# Altium project Self_Sensing_Board_V1.PrjPcb
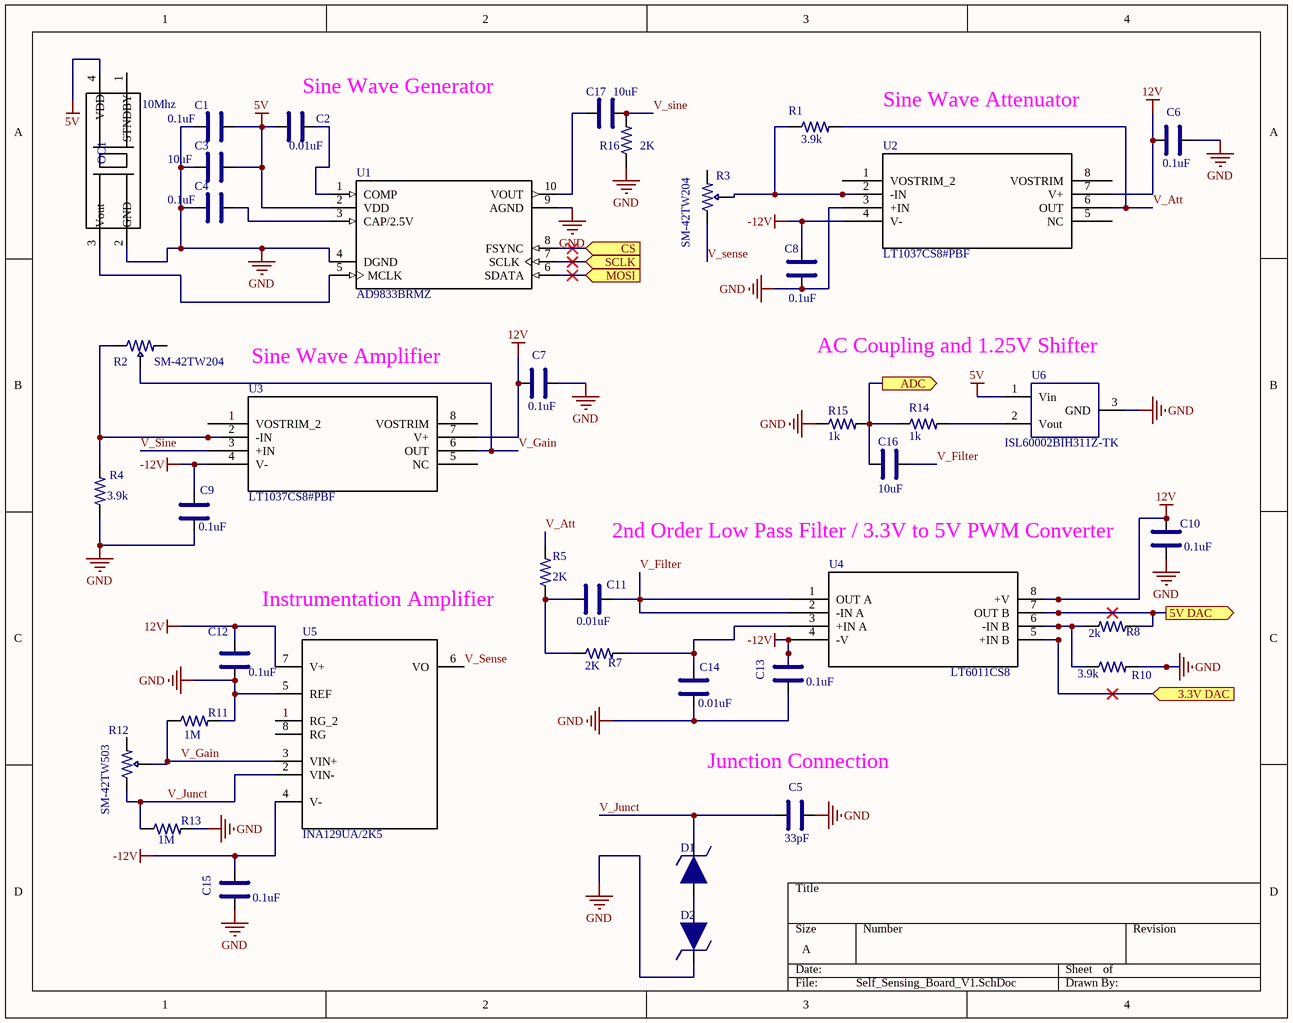
[diagram p0: Self_Sensing_Board_V1.SchDoc]
1 sheet, 40 parts. Net scope: flat (ports and power ports of the same name join across sheets).
Board file: Self_Sensing_Board_V1.PcbDoc

## Sheet Self_Sensing_Board_V1.SchDoc
size A

### Parts
C1  value 0.1uF  [CL03A104KA3NNNC]  (hidden comment: CL03A104KA3NNNC)
C2  value 0.01uF  [CL03B103KP3NNNC]  (hidden comment: CL03B103KP3NNNC)
C3  value 10uF  [GRM155R60J106ME47D]  (hidden comment: GRM155R60J106ME47D)
C4  value 0.1uF  [CL03A104KA3NNNC]  (hidden comment: CL03A104KA3NNNC)
C5  value 33pF  [GRM155R60J106ME47D]  (hidden comment: GRM1555C1H330FA01D)
C6  value 0.1uF  [CL03A104KA3NNNC]  (hidden comment: CL03A104KA3NNNC)
C7  value 0.1uF  [CL03A104KA3NNNC]  (hidden comment: CL03A104KA3NNNC)
C8  value 0.1uF  [CL03A104KA3NNNC]  (hidden comment: CL03A104KA3NNNC)
C9  value 0.1uF  [CL03A104KA3NNNC]  (hidden comment: CL03A104KA3NNNC)
C10  value 0.1uF  [CL03A104KA3NNNC]  (hidden comment: CL03A104KA3NNNC)
C11  value 0.01uF  [CL03B103KP3NNNC]  (hidden comment: CL03B103KP3NNNC)
C12  value 0.1uF  [CL03A104KA3NNNC]  (hidden comment: CL03A104KA3NNNC)
C13  value 0.1uF  [CL03A104KA3NNNC]  (hidden comment: CL03A104KA3NNNC)
C14  value 0.01uF  [CL03B103KP3NNNC]  (hidden comment: CL03B103KP3NNNC)
C15  value 0.1uF  [CL03A104KA3NNNC]  (hidden comment: CL03A104KA3NNNC)
C16  value 10uF  [GRM155R60J106ME47D]  (hidden comment: GRM155R60J106ME47D)
C17  value 10uF  [CL03A104KA3NNNC]  (hidden comment: CL03A104KA3NNNC)
D1  DDZ9713S-7  [SOD323]  (value not drawn)
D2  DDZ9713S-7  [SOD323]  (value not drawn)
OC1  value 10Mhz  [LFSPXO017735REEL]  (hidden comment: LFSPXO017735REEL)
R1  value 3.9k  [RC0201FR-07130KL]  (hidden comment: RC0201FR-073K9L)
R2  SM-42TW204  [SM-42TW503]
R3  SM-42TW204  [SM-42TW503]
R4  value 3.9k  [RC0201FR-07130KL]  (hidden comment: RC0201FR-073K9L)
R5  value 2K  [RC0603F202CS]  (hidden comment: RC0603F202CS)
R7  value 2K  [RC0603F202CS]  (hidden comment: RC0603F202CS)
R8  value 2k  [RC0603F202CS]  (hidden comment: RC0603F202CS)
R10  value 3.9k  [RC0201FR-07130KL]  (hidden comment: RC0201FR-073K9L)
R11  value 1M  [CRCW04021M00DHEDP]  (hidden comment: CRCW04021M00DHEDP)
R12  SM-42TW503  [SM-42TW503]
R13  value 1M  [CRCW04021M00DHEDP]  (hidden comment: CRCW04021M00DHEDP)
R14  value 1k  [RC0603F202CS]  (hidden comment: RC0201FR-071KL)
R15  value 1k  [RC0603F202CS]  (hidden comment: RC0201FR-071KL)
R16  value 2K  [CRCW04021M00DHEDP]  (hidden comment: CRCW04021M00DHEDP)
U1  AD9833BRMZ  [AD9833BRMZ]
U2  LT1037CS8#PBF  [LT1037CS8#PBF]
U3  LT1037CS8#PBF  [LT1037CS8#PBF]
U4  LT6011CS8  [LT1037CS8#PBF]
U5  INA129UA/2K5  [INA129UA/2K5]
U6  ISL60002BIH311Z-TK  [ISL60002-12]

### Ports
3.3V DAC (in), 5V DAC (out), ADC (out), CS (in), MOSI (in), SCLK (in)

### Nets
5V: C1.1 C2.2 C3.1 OC1.4(VDD) U1.2(VDD) U6.1(Vin)
12V: C6.2 C7.2 C10.1 C12.1 U2.7(V+) U3.7(V+) U4.8(+V) U5.7(V+)
-12V: C8.1 C9.1 C13.1 C15.1 U2.4(V-) U3.4(V-) U4.4(-V) U5.4(V-)
GND: C1.2 C3.2 C4.2 C5.1 C6.1 C7.1 C8.2 C9.2 C10.2 C12.2 C13.2 C14.2 C15.2 D2.1 OC1.2(GND) R4.2 R10.1 R11.1 R13.1 R15.2 R16.2 U1.4(DGND) U1.9(AGND) U2.3(+IN) U5.5(REF) U6.3(GND)
V_Att: R1.1 R5.1 U2.6(OUT)
V_Filter: C11.1 C16.1 U4.1(OUT_A) U4.2(-IN_A)
V_Gain: R2.2 R11.2 R12.2 U3.6(OUT) U5.3(VIN+)
V_Junct: C5.2 D1.1 R12.1 R13.2 U5.2(VIN-)
V_sense: R3.1 U5.6(VO)
V_Sine: C17.2 R16.1 U3.3(+IN)
NetC2_1: C2.1 U1.1(COMP)
NetC4_1: C4.1 U1.3(CAP/2.5V)
NetC11_2: C11.2 R5.2 R7.1
NetC14_1: C14.1 R7.2 U4.3(+IN_A)
NetC16_2: C16.2 R14.2 R15.1 ; port ADC
NetC17_1: C17.1 U1.10(VOUT)
NetD1_2: D1.2 D2.2
NetOC1_3: OC1.3(Vout) U1.5(MCLK)
NetR1_2: R1.2 R3.2 U2.2(-IN)
NetR2_1: R2.1 R4.1 U3.2(-IN)
NetR8_1: R8.1 R10.2 U4.6(-IN_B)
NetR8_2: R8.2 U4.7(OUT_B) ; port 5V DAC
NetR14_1: R14.1 U6.2(Vout)
NetU1_6: U1.6(SDATA) ; port MOSI
NetU1_7: U1.7(SCLK) ; port SCLK
NetU1_8: U1.8(FSYNC) ; port CS
NetU4_5: U4.5(+IN_B) ; port 3.3V DAC

Not connected (* = marked no-connect by the designer): OC1 1(STNDBY); R2 3; R3 3; R12 3; U2 1(VOSTRIM_2) 5(NC) 8(VOSTRIM); U3 1(VOSTRIM_2) 5(NC) 8(VOSTRIM); U5 1(RG_2) 8(RG)

### Notes on the sheet
- (near C2) Sine Wave Generator
- Sine Wave Attenuator
- Sine Wave Amplifier
- (near U6) AC Coupling and 1.25V Shifter
- (near C10) 2nd Order Low Pass Filter / 3.3V to 5V PWM Converter
- (near R5) Instrumentation Amplifier
- Junction Connection

### Library data of the parts
C1 C4 C6-C10 C12 C13 C15 C17 = CL03A104KA3NNNC: CAP CER 0.1UF 25V X5R 0201; Manufacturer: Samsung; Package: 0201 (0603 Metric); Manufacturer Part Number: CL03A104KA3NNNC; Digikey Part Number: 1276-1318-6-ND; Voltage Rated: 25V; Temperature Coefficient: X5R; Unit Price: $0.75; Supplier: Digikey
C2 C11 C14 = CL03B103KP3NNNC: CAP CER 10000PF 10V X7R 0201; Manufacturer: Samsung; Package: 0201 (0603 Metric); Manufacturer Part Number: CL03B103KP3NNNC; Digikey Part Number: 1276-1152-1-ND; Voltage Rated: 10V; Temperature Coefficient: X7R; Unit Price: 0.13; Supplier: Digikey
C3 C16 = GRM155R60J106ME47D: CAP CER 10UF 6.3V X5R 0402; Manufacturer: Murata; Package: 0402 (1005 Metric); Manufacturer Part Number: GRM155R60J106ME47D; Digikey Part Number: 490-13239-1-ND; Voltage Rated: 6.3V; Temperature Coefficient: X5R; Unit Price: $0.85; Supplier: Digikey
C5 = GRM1555C1H330FA01D: CAP CER 33PF 50V C0G/NP0 0402; Manufacturer: Murata; Temperature Coefficient: COG; Package: 0402 (1005 Metric); Manufacturer Part Number: GRM1555C1H330FA01D; Digikey Part Number: 490-6231-1-ND; Voltage Rated: 50V; Unit Price: $0.85; Supplier: Digikey
D1 D2 = DDZ9713S-7: DIODE ZENER 30V 200MW SOD323; Manufacturer: Diodes Incorporated; Package: 0201 (0603 Metric); Manufacturer Part Number: DDZ9713S-7; Digikey Part Number: DDZ9713S-7DICT-ND; Unit Price: $0.49; Supplier: Digikey; V Zener: 30V
OC1 = LFSPXO017735REEL: XTAL OSC XO 10.0000MHZ HCMOS TTL; Manufacturer: IQD Frequency Products; Package: 4-SMD; Manufacturer Part Number: LFSPXO017735REEL; Digikey Part Number: 1923-1091-1-ND; Unit Price: 1; Supplier: Digikey
R1 R4 R10 = RC0201FR-073K9L: RES SMD 3.9K OHM 1% 1/20W 0201; Manufacturer: Yageo; Power (Watts): 0.05W; Package: 0201 (0603 Metric); Manufacturer Part Number: RC0201FR-073K9L; Digikey Part Number: YAG2655CT-ND; Unit Price: 0.1; Supplier: Digikey
R2 R3 = SM-42TW204: TRIMMER 200KOHM 0.25W J LEAD TOP; Manufacturer: Nidec Copal Electronics; Vendor: Digikey; Digikey Part Number: SM-42TW204CT-ND; Unit Price: 3.67; Manufacturer Part Number: SM-42TW204
R5 R7 R14 R15 = RC0201FR-071KL: RES SMD 1K OHM 1% 1/20W 0201; Manufacturer: Yageo; Power (Watts): 0.05W; Package: 0201 (0603 Metric); Manufacturer Part Number: RC0201FR-071KL; Digikey Part Number: 311-1KMCT-ND; Unit Price: 0.1; Supplier: Digikey
R8 = RC0603F202CS: RES SMD 2K OHM 1% 1/20W 0201; Manufacturer: Samsung; Power (Watts): 0.05W; Package: 0201 (0603 Metric); Manufacturer Part Number: RC0603F202CS; Digikey Part Number: 1276-3633-1-ND; Unit Price: 0.1; Supplier: Digikey
R11 R13 R16 = CRCW04021M00DHEDP: RES SMD 1M OHM 0.5% 1/16W 0402; Manufacturer: Vishay Dale; Power (Watts): 0.063W; Package: 0402; Manufacturer Part Number: CRCW04021M00DHEDP; Digikey Part Number: 541-1.0MAVCT-ND; Unit Price: 0.3; Supplier: Digikey
R12 = SM-42TW503: TRIMMER 50K OHM 0.25W J LEAD TOP; Manufacturer: Nidec Copal Electronics; Vendor: Digikey; Digikey Part Number: SM-42TW503CT-ND; Unit Price: 3.67; Manufacturer Part Number: SM-42TW503
U1 = AD9833BRMZ: Direct Digital Synthesizer 25MHz 1-DAC 10-Bit Serial 10-Pin MSOP Tube; MF: Analog Devices; MP: AD9833BRMZ; Price: 10.14; Package: MSOP-10 Analog Devices; Digikey Part Number: ‎AD9833BRMZ-ND‎
U2 U3 = LT1037CS8#PBF: IC OPAMP GP 60MHZ 8SO; Manufacturer: Linear Technology; Value: 15.85k; Package: 8-SOIC; Manufacturer Part Number: LT1037CS8#PBF; Digikey Part Number: LT1037CS8#PBF-ND; Unit Price: $4.23; Supplier: Digikey
U4 = LT6011AIDD#PBF: IC OPAMP GP 350KHZ RRO 8DFN; Manufacturer: Analog Device; Package: 8 DFN; Manufacturer Part Number: LT6011AIDD#PBF; Digikey Part Number: LT6011AIDD#PBF-ND; Unit Price: $8.43; Supplier: Digikey
U5 = INA129UA/2K5: IC OPAMP INSTR 1.3MHZ 8SOIC; Manufacturer: Texas Instruments; Package: 8-SOIC; Manufacturer Part Number: INA129UA/2K5; Digikey Part Number: 296-26058-1-ND; Unit Price: $7.46; Supplier: Digikey
U6 = ISL60002BIH311Z-TK: IC VREF SERIES 1.2V SOT23-3; Manufacturer: Renesas Electronics; Package: SOT-23-3; Manufacturer Part Number: ISL60002BIH311Z-TK; Digikey Part Number: ISL60002BIH311Z-TKCT-ND; Unit Price: $6.41; Supplier: Digikey